# EAGLE design nor_ppalette (EAGLE 9.6.2)
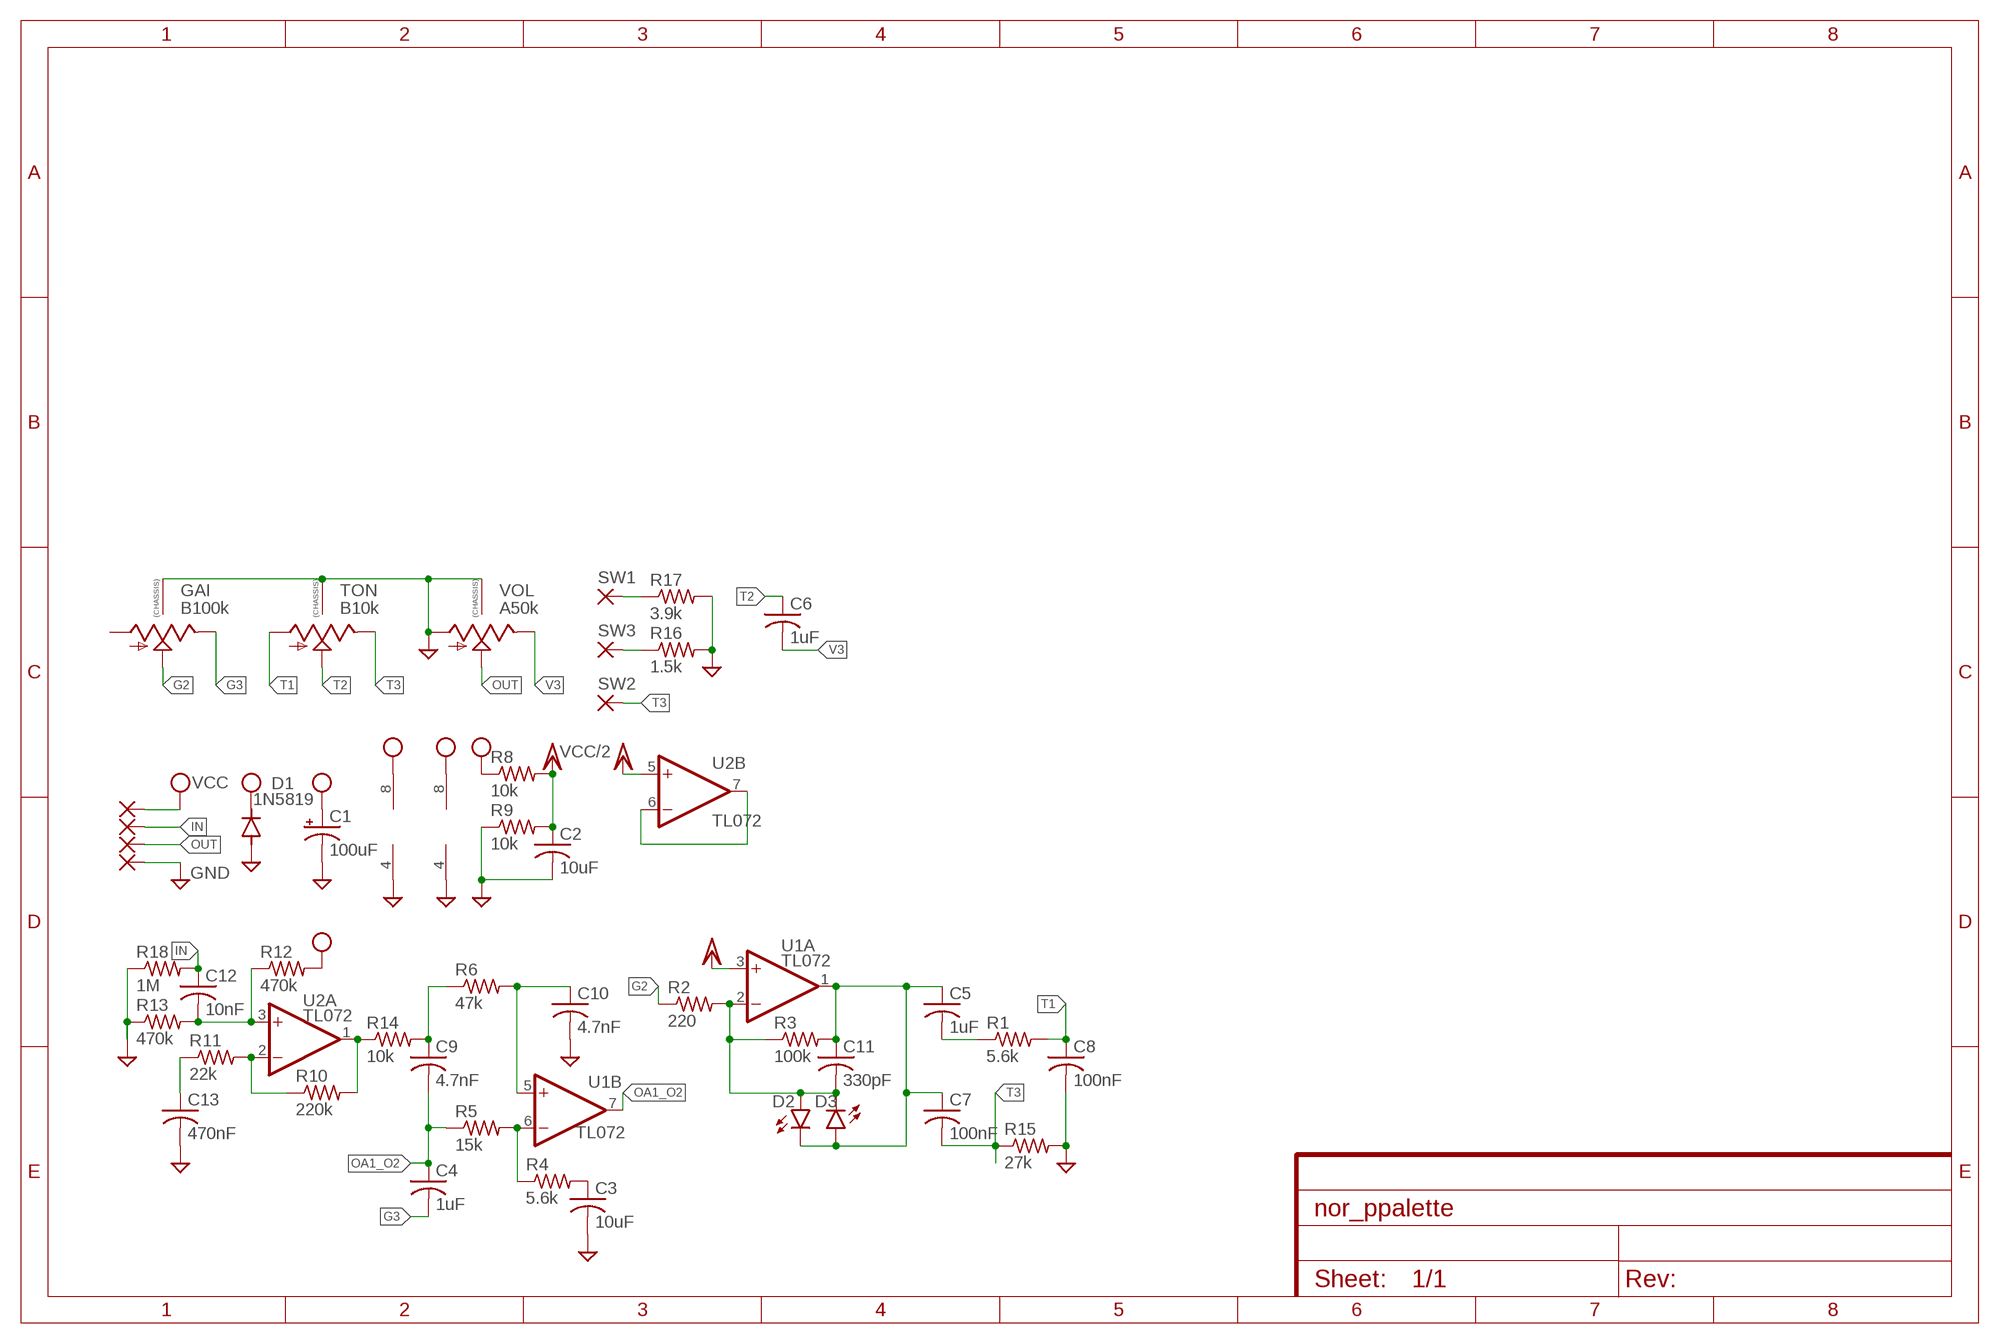
[diagram p0: schematic, sheet 1]

## Parts
C1  100uF  100UF-POLAR-RADIAL-2.5MM-25V-20%  [CPOL-RADIAL-2.5MM-6.5MM]
C2  10uF  C-USC1206  [C1206]
C3  10uF  C-USC1206  [C1206]
C4  1uF  C-USC0805  [C0805]
C5  1uF  C-USC0805  [C0805]
C6  1uF  C-USC0805  [C0805]
C7  100nF  C-USC0603  [C0603]
C8  100nF  C-USC0603  [C0603]
C9  4.7nF  C-USC0603  [C0603]
C10  4.7nF  C-USC0603  [C0603]
C11  330pF  C-USC0603  [C0603]
C12  10nF  C-USC0603  [C0603]
C13  470nF  C-USC0603  [C0603]
D1  1N5819  DIODE-SOD123  [SOD123]
D2  LED0603  [LED-0603]
D3  LED0603  [LED-0603]
GAI  B100k  9MM_SNAP-IN_POT_CHASSIS  [9MM_SNAP-IN_POT]
PAD1  1,6/0,8  [1,6/0,8]
PAD2  1,6/0,8  [1,6/0,8]
PAD3  1,6/0,8  [1,6/0,8]
PAD4  1,6/0,8  [1,6/0,8]
R1  5.6k  R-US_R0603  [R0603]
R2  220  R-US_R0603  [R0603]
R3  100k  R-US_R0603  [R0603]
R4  5.6k  R-US_R0603  [R0603]
R5  15k  R-US_R0603  [R0603]
R6  47k  R-US_R0603  [R0603]
R8  10k  R-US_R0603  [R0603]
R9  10k  R-US_R0603  [R0603]
R10  220k  R-US_R0603  [R0603]
R11  22k  R-US_R0603  [R0603]
R12  470k  R-US_R0603  [R0603]
R13  470k  R-US_R0603  [R0603]
R14  10k  R-US_R0603  [R0603]
R15  27k  R-US_R0603  [R0603]
R16  1.5k  R-US_R0603  [R0603]
R17  3.9k  R-US_R0603  [R0603]
R18  1M  R-US_R0603  [R0603]
SW1  1,6/0,8  [1,6/0,8]
SW2  1,6/0,8  [1,6/0,8]
SW3  1,6/0,8  [1,6/0,8]
TON  B10k  9MM_SNAP-IN_POT_CHASSIS  [9MM_SNAP-IN_POT]
U1  TL072  TL072TSSOP  [TSSOP-8]
U2  TL072  TL072TSSOP  [TSSOP-8]
VOL  A50k  9MM_SNAP-IN_POT_CHASSIS  [9MM_SNAP-IN_POT]

## Nets
G2: GAI.2(S) R2.1
G3: C4.2 GAI.3(E)
GND: C1.2(-) C2.2 C3.2 C8.2 C10.2 C13.2 D1.A GAI.CHASSIS1 GAI.CHASSIS2 PAD4.1(P) R9.1 R13.1 R15.2 R16.2 R17.2 R18.1 TON.CHASSIS1 TON.CHASSIS2 U1.4(P:V-) U2.4(P:V-) VOL.1(A) VOL.CHASSIS1 VOL.CHASSIS2
IN: C12.1 PAD2.1(P) R18.2
N$1: R10.1 R11.2 U2.2(A:-IN)
N$2: U2.6(B:-IN) U2.7(B:OUT)
N$3: C12.2 R12.1 R13.2 U2.3(A:+IN)
N$4: R10.2 R14.1 U2.1(A:OUT)
N$5: C13.1 R11.1
N$6: C9.1 R6.1 R14.2
N$7: C10.1 R6.2 U1.5(B:+IN)
N$8: R4.1 R5.2 U1.6(B:-IN)
N$9: C3.1 R4.2
N$10: C5.1 C7.1 C11.1 D2.C D3.A R3.2 U1.1(A:OUT)
N$11: C11.2 D2.A D3.C R2.2 R3.1 U1.2(A:-IN)
N$12: C5.2 R1.1
N$13: R17.1 SW1.1(P)
N$14: R16.1 SW3.1(P)
OA1_O2: C4.1 C9.2 R5.1 U1.7(B:OUT)
OUT: PAD3.1(P) VOL.2(S)
T1: C8.1 R1.2 TON.1(A)
T2: C6.1 TON.2(S)
T3: C7.2 R15.1 SW2.1(P) TON.3(E)
V3: C6.2 VOL.3(E)
VCC: C1.1(+) D1.C PAD1.1(P) R8.1 R12.2 U1.8(P:V+) U2.8(P:V+)
VCC/2: C2.1 R8.2 R9.2 U1.3(A:+IN) U2.5(B:+IN)
Unconnected: GAI.1(A)

## Library data of the parts
C1 = SparkFun-Capacitors:100UF-POLAR: 100µF polarized capacitors A capacitor is a passive two-terminal electrical component used to store electrical energy temporarily in an electric field.; PROD_ID: CAP-08439
C2-C13 = adafruit:C-US: CAPACITOR, American symbol
D1 = diode:DIODE-: DIODE
D2 D3 = SparkFun-LED:LED: LED (Generic) Standard schematic elements and footprints for 5mm, 3mm, 1206, and 0603 sized LEDs. Generic LEDs with no color specified.
GAI TON VOL = MusicThingModular:9MM_SNAP-IN_POT_CHASSIS: 9mm vertical snap-in pot, Alpha / Panasonic style, with a connection to the metal chassis for grounding
PAD1-PAD4 SW1-SW3 = wirepad:1,6/0,8: THROUGH-HOLE PAD
R1-R6 R8-R18 = adafruit:R-US_: RESISTOR, American symbol
U1 U2 = MusicThingModular:TL072: Generic Dual Op Amp

## Board
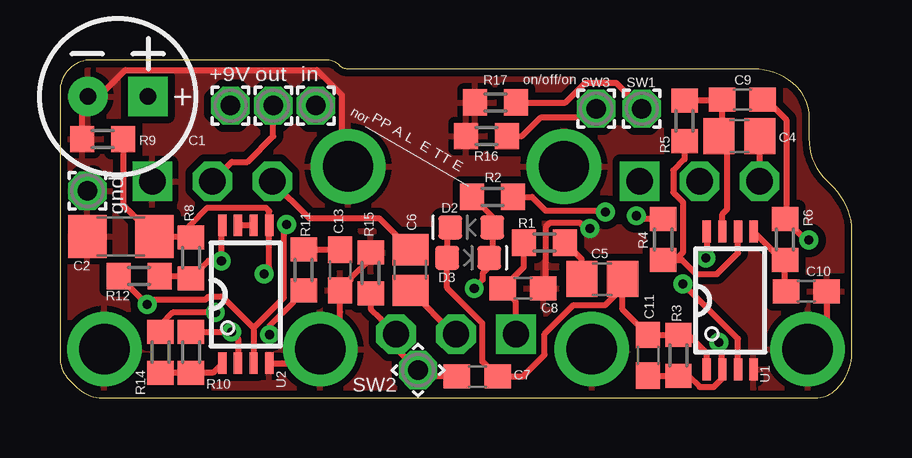
[diagram p1: board, top side]
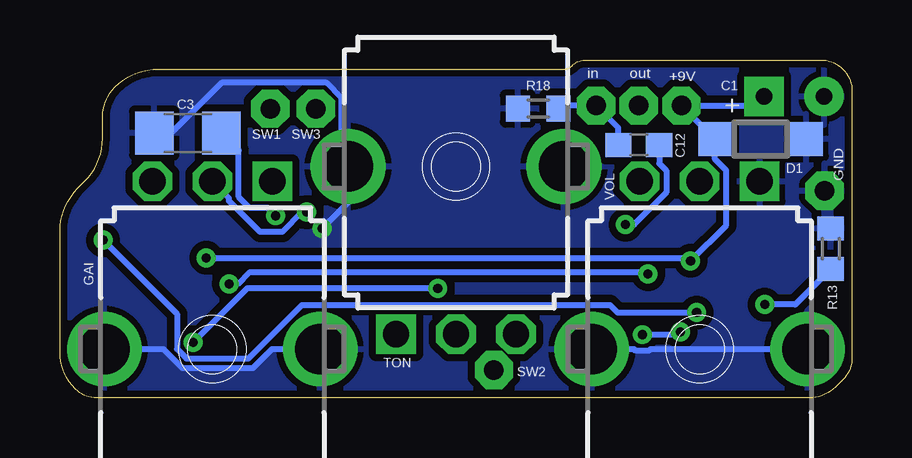
[diagram p2: board, bottom side, seen from below]

Size 33.02 x 14.1 mm. Coordinates in mm from the lower left corner, seen from the top.
Outline: 1.78,0 31.5,0 arc45 32.36,0.36 32.39,0.39 arc45 33.02,1.91 33.02,6.95 arc45 32.28,8.74 31.99,9.04 arc-45 31.24,10.83 31.24,11.73 arc45 30.73,12.95 30.72,12.97 arc45 28.92,13.72 11.99,13.72 arc-45 11.68,13.84 arc45 11.07,14.1 1.3,14.1 arc45 0.38,13.72 arc45 0,12.8 0,1.68 arc45 0.38,0.76 0.69,0.45 arc45 1.78,0
Copper layers (1*16): Top 0.035mm / dielectric 1.5mm / Bottom 0.035mm
Design rules "default *": minimum track width 6mil, minimum drill 0.35mm, track to track 6mil, track to pad 6mil, pad to pad 6mil, via to via 6mil, smd to smd 6mil, copper to edge 10mil, drill to drill 6mil, minimum pad ring 10mil, minimum via ring 8mil, stop-mask expansion 4mil, vias tented up to drill 0mil, thermal gap 10mil

### Footprints (pad centres in the part's own frame; a part is rotated, then mirrored left to right if it is on the bottom)
CPOL-RADIAL-2.5MM-6.5MM = drill 0.7 pad 1.651 square: 1 1.25,0 | drill 0.7 pad 1.651: 2 -1.25,0
C1206 = smd 1.6 x 1.8: 1 -1.4,0; 2 1.4,0
C0805 = smd 1.3 x 1.5: 1 -0.85,0; 2 0.85,0
C0603 = smd 1.1 x 1: 1 -0.85,0; 2 0.85,0
SOD123 = smd 1.4 x 1.4: A 1.9,0; C -1.9,0
LED-0603 = smd 1 x 1: A -0.877,0; C 0.877,0
9MM_SNAP-IN_POT = drill 1.1 square: 1 -2.5,-7 | drill 1.1 octagon: 2 0,-7; 3 2.5,-7 | drill 2.1 pad 2.794: CHASSIS1 -4.5,0; CHASSIS2 4.5,0
1,6/0,8 = drill 0.813 pad 1.6 octagon: 1 0,0
R0603 = smd 1 x 1.1: 1 -0.85,0; 2 0.85,0
TSSOP-8 = smd 0.9 x 0.35: 1 -2.875,0.975; 2 -2.875,0.325; 3 -2.875,-0.325; 4 -2.875,-0.975; 5 2.875,-0.975; 6 2.875,-0.325; 7 2.875,0.325; 8 2.875,0.975

### Placement (x,y rotation side)
C1  2.41,12.57 0 top
C2  2.54,6.73 180 top
C3  27.69,11.05 180 bottom
C4  28.32,10.92 0 top
C5  22.61,4.95 180 top
C6  14.61,5.33 90 top
C7  17.4,0.89 180 top
C8  19.3,4.57 0 top
C9  28.45,12.45 180 top
C10  31.11,4.45 0 top
C11  24.51,1.78 270 top
C12  8.89,10.54 0 bottom
C13  11.68,5.33 270 top
D1  3.81,10.79 0 bottom
D2  17.14,7.11 180 top
D3  17.02,5.84 0 top
GAI  26.67,2.03 180 bottom
PAD1  7.11,12.19 0 top
PAD2  10.67,12.19 0 top
PAD3  8.89,12.19 0 top
PAD4  1.14,8.64 0 top
R1  20.19,6.48 180 top
R2  18.03,8.38 180 top
R3  25.78,1.78 90 top
R4  25.15,6.6 90 top
R5  26.04,11.56 270 top
R6  30.23,6.6 270 top
R8  5.46,5.84 90 top
R9  1.78,10.79 0 top
R10  5.46,1.91 270 top
R11  10.16,5.33 270 top
R12  3.3,5.08 0 top
R13  0.89,6.22 270 bottom
R14  4.19,1.91 90 top
R15  12.95,5.21 90 top
R16  17.78,10.92 180 top
R17  18.16,12.32 180 top
R18  13.08,12.06 0 bottom
SW1  24.26,12.06 0 top
SW2  14.93,1.16 45 top
SW3  22.35,12.06 0 top
TON  16.51,9.65 0 bottom
U1  27.94,4.06 90 top
U2  7.75,4.32 90 top
VOL  6.35,2.03 180 bottom

### Tracks (layer width: path | path; a pad name or v marks a point on that pad's centre or on a via)
G2  (via drill 0.38)
  Top 0.254: R2.1 19.68,8.38 20.25,7.82 22.66,7.82 v22.73,7.75
  Bottom 0.254: GAI.2 25.97,8.33 25.97,8.21 24.68,6.92 23.75,6.92 22.92,7.75 v22.73,7.75
G3
  Top 0.254: GAI.3 C4.2
GND  (via drill 0.38)
  Top 0.254: U2.4 10.26,1.44 VOL.CHASSIS2 11.68,2.87 C13.2 12.12,4.92 12.12,4.97 12.95,5.8 R15.2 | C8.2 20.26,4.68 20.26,7.14 20.43,7.31 21.66,7.31 21.9,7.06 v22.09,7.06 | C10.2 31.96,2.83 GAI.CHASSIS2 | R9.1 0.93,12.34 C1.2 1.62,12.57 2.72,13.68 10.71,13.68 11.75,12.64 11.75,9.91 TON.CHASSIS2
  Bottom 0.254: VOL.CHASSIS1 8.4,2.03 8.47,1.97 9.03,1.97 9.09,2.03 VOL.CHASSIS2 | v22.09,7.06 21.01,8.14 TON.CHASSIS1 21.27,9.91 21.27,12.51 21.91,13.14 26.29,13.14 28.38,11.05 C3.2 | GAI.CHASSIS1 24.19,2.03 24.99,1.24 27.91,1.24 28.7,2.03 GAI.CHASSIS2
  pour Top (isolate 0.305): -1.27,15.24 -1.27,-1.27 34.29,-1.27 34.29,15.24
  pour Bottom (isolate 0.305): -1.27,15.24 -1.27,-1.27 34.29,-1.27 34.29,15.24
IN
  Bottom 0.254: C12.1 9.74,11.26 PAD2.1 12.1,12.19 R18.2
N$1  (via drill 0.38)
  Top 0.254: R10.1 v7.15,2.75 7.42,2.48 U2.2 | R11.2 9.74,4.06 9.74,4.01 8.75,3.02 v8.75,2.64
  Bottom 0.254: v8.75,2.64 7.27,2.64 v7.15,2.75
N$2
  Top 0.254: U2.6 U2.7
N$3  (via drill 0.38)
  Top 0.254: R12.1 v3.64,3.89 3.83,4.09 6.06,4.09 6.2,4.23 6.76,4.23 8.07,2.92 | 8.07,2.92 U2.3 | v9.44,7.23 9.33,7.12 9.33,4.18 8.07,2.92
  Bottom 0.254: R13.2 2.37,3.89 v3.64,3.89 | C12.2 8.04,9.78 7.75,9.49 7.75,8.57 9.09,7.23 v9.44,7.23
N$4
  Top 0.254: U2.1 6.38,1.05 R10.2 R14.1
N$5
  Top 0.254: R11.1 C13.1
N$6  (via drill 0.38)
  Top 0.254: C9.1 29.44,12.45 30.27,11.61 30.27,7.5 R6.1 31.1,6.58 v31.22,6.58 | v6.48,3.56 4.7,3.56 4.19,3.05 R14.2
  Bottom 0.254: v6.48,3.56 9.78,3.56 10.09,3.87 22.93,3.87 25.16,1.64 27.74,1.64 28.14,2.04 28.14,3.5 v31.22,6.58
N$7
  Top 0.254: C10.1 30.23,4.48 R6.2 30.1,5.75 U1.5
N$8
  Top 0.254: R5.2 26.04,9.96 25.57,9.49 25.57,8.57 25.98,8.16 25.98,6.08 25.65,5.75 R4.1 25.93,5.75 26.52,5.17 27.39,5.17 28.27,6.04 U1.6
N$9  (via drill 0.38)
  Top 0.254: R4.2 24.17,7.45 v24.03,7.59
  Bottom 0.254: v24.03,7.59 24.36,7.93 25.11,7.93 25.57,8.38 25.57,10.33 C3.1
N$10
  Top 0.254: U1.1 26.96,1.86 26.2,2.63 R3.2 C11.1 23.46,3.68 23.46,4.59 | D2.C 16.14,6.99 D3.A 16.14,4.58 17.61,3.11 17.61,1.52 C7.1 19.29,0.89 20.21,1.8 20.21,2.67 21.41,3.87 22.73,3.87 23.46,4.59 | 23.46,4.59 C5.1
N$11  (via drill 0.38)
  Top 0.254: C11.2 R3.1 26.21,0.93 26.67,0.46 27.26,0.46 27.61,0.82 U1.2 27.59,1.21 27.59,2.19 v27.46,2.32 | R2.2 18.02,7.54 D2.A 18.02,5.97 D3.C 17.89,5.46 17.62,5.19 17.62,4.92 v17.27,4.57
  Bottom 0.254: v17.27,4.57 25.21,4.57 v27.46,2.32
N$12
  Top 0.254: C5.2 21.76,5.76 R1.1
N$13
  Top 0.254: R17.1 21.08,12.32 21.91,13.14 23.18,13.14 SW1.1
N$14
  Top 0.254: R16.1 19.27,10.92 20.03,11.68 21.97,11.68 SW3.1
OA1_O2
  Top 0.254: U1.7 27.61,7.68 27.81,7.87 27.81,10.58 C4.1 27.6,11.05 C9.2 27.56,12.41 R5.1
OUT
  Top 0.254: VOL.2 7.16,9.84 7.82,9.84 8.89,10.91 PAD3.1
T1
  Top 0.254: TON.1 19.01,4.02 C8.1 19.34,5.46 R1.2
T2
  Top 0.254: TON.2 16.44,2.65 C6.1
T3
  Top 0.254: R15.1 12.95,3.72 13.38,3.3 13.38,3.29 TON.3 14.01,2.08 SW2.1 15.2,0.89 C7.2
V3
  Top 0.254: VOL.3 10.39,7.49 13.3,7.49 C6.2
VCC  (via drill 0.38)
  Top 0.254: R12.2 5.37,5.08 R8.1 6.18,5.71 v6.73,5.71 6.73,7.15 U2.8 | U1.8 26.96,5.88 v26.92,5.84
  Bottom 0.254: C1.1 4.04,12.19 PAD1.1 D1.C 5.71,9.95 5.25,9.49 5.25,7.2 v6.73,5.71 6.86,5.84 v26.92,5.84
VCC/2  (via drill 0.38)
  Top 0.254: 5.42,6.73 C2.1 2.63,8.04 R9.2 | 5.42,6.73 R8.2 | U1.3 28.27,2.47 v25.97,4.76 | v8.51,5.17 8.72,5.38 U2.5 8.72,7.79 8.59,7.92 6.14,7.92 5.42,7.2 5.42,6.73
  Bottom 0.254: v25.97,4.76 25.6,4.76 25.11,5.25 8.59,5.25 v8.51,5.17

### Text on the board
tPlace: +9V | out | in | on/off/on | SW3 | SW1 | + | nor_______________ | PP A L E TT E | gnd | SW2
bPlace: C1 | +9V | out | in | + | SW3 | SW1 | GND | SW2